# EAGLE design ups-node-atmega168 (EAGLE 7.4.0)
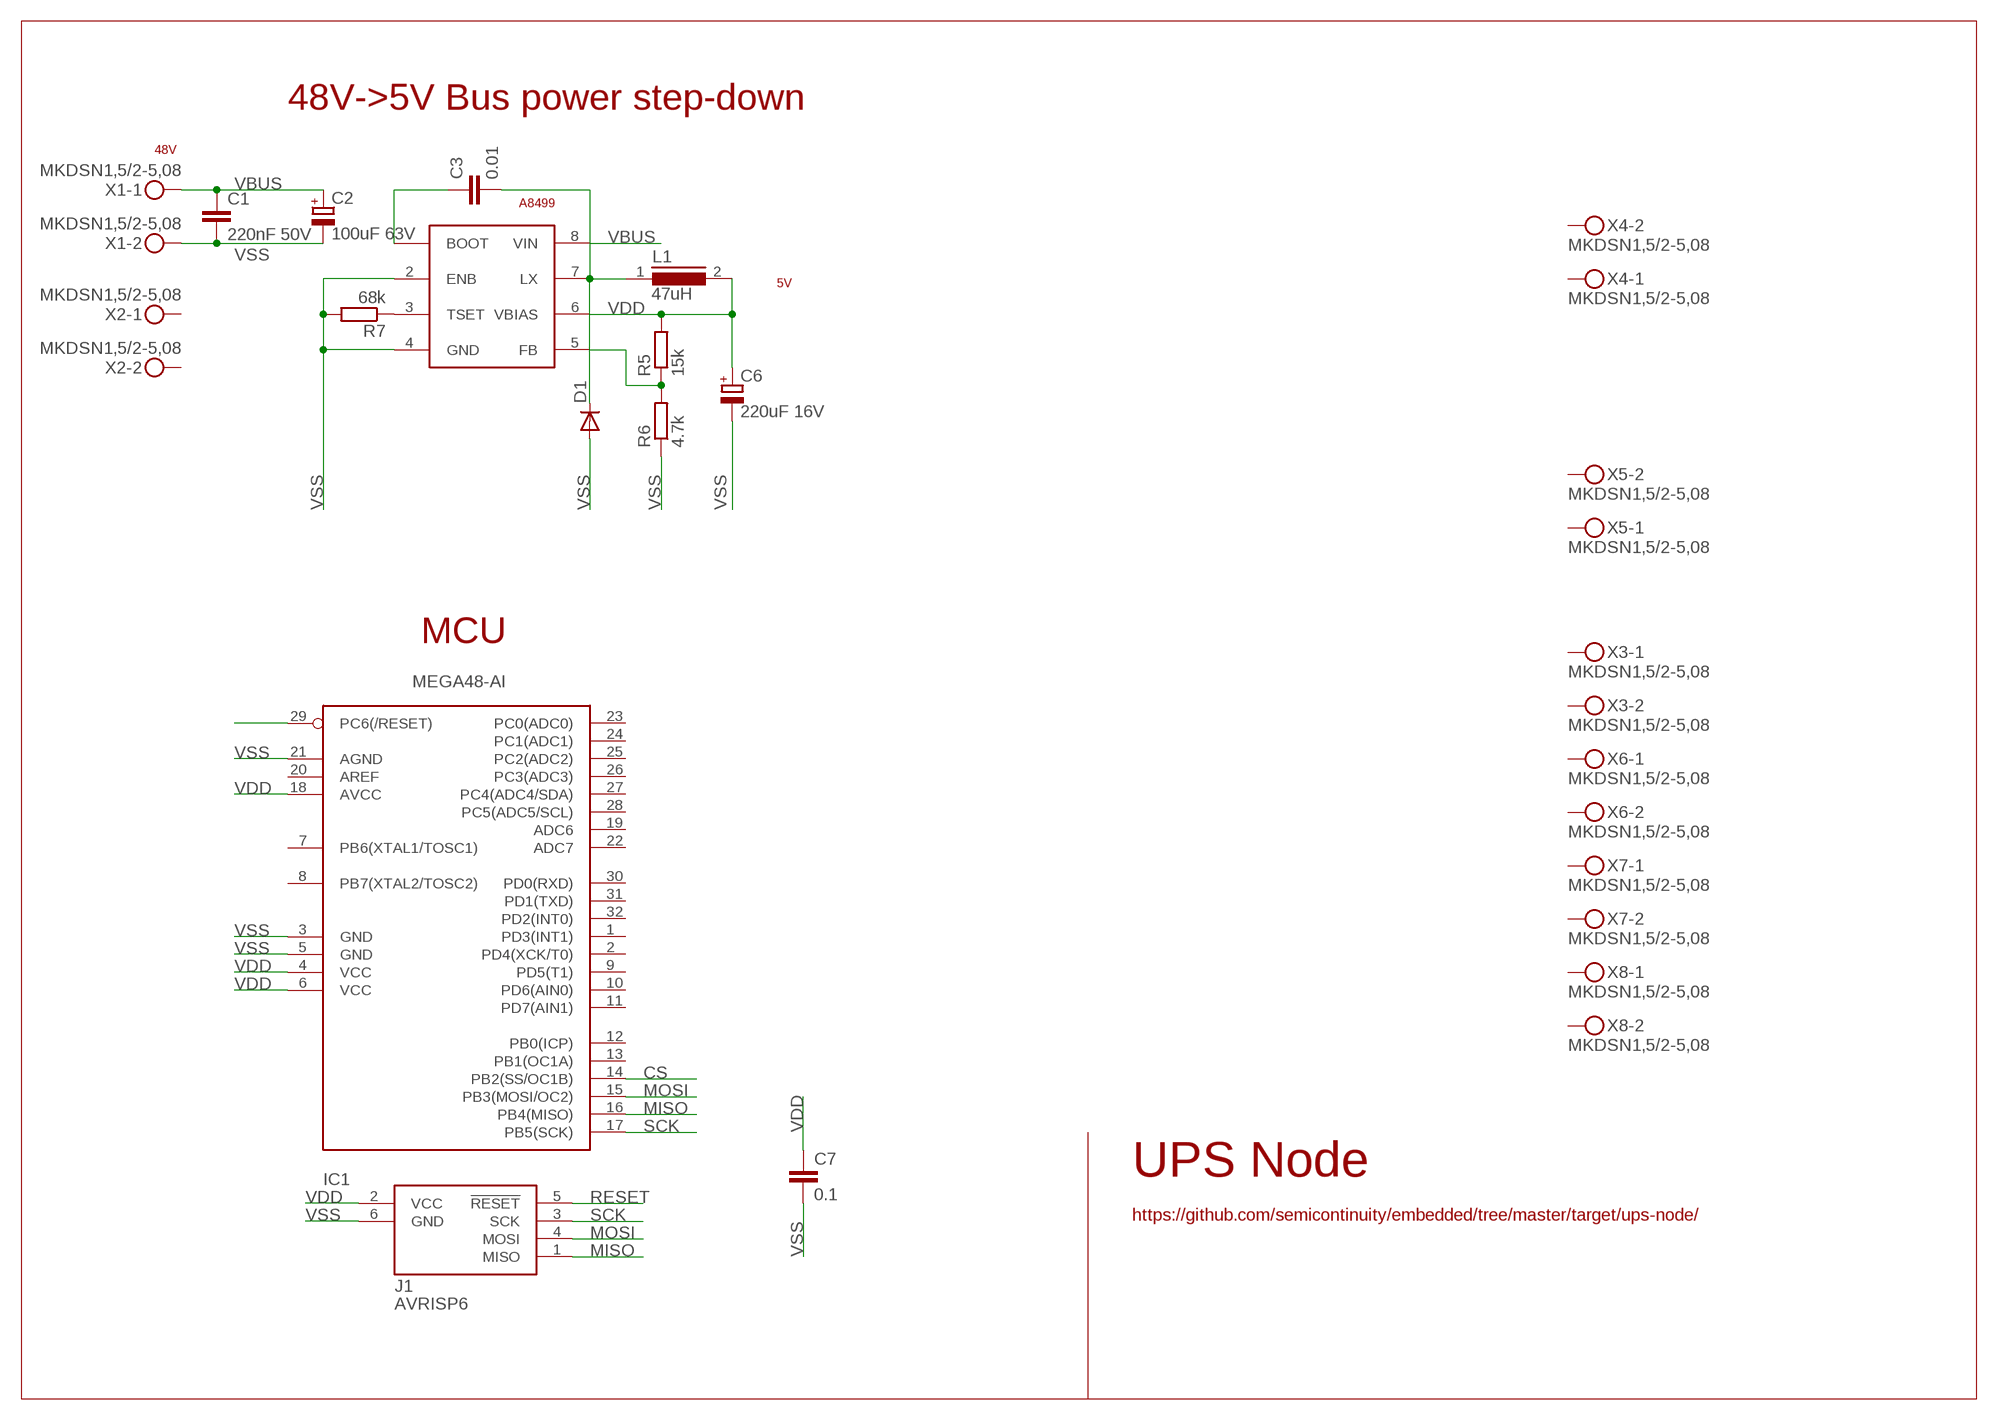
[diagram p0: schematic, sheet 1]

## Parts
C1  220nF 50V  C-EUC0805  [C0805]
C2  100uF 63V  CPOL-EU153CLV-1010  [153CLV-1010]
C3  0.01  C-EUC0805  [C0805]
C6  220uF 16V  CPOL-EU153CLV-0605  [153CLV-0605]
C7  0.1  C-EUC0805  [C0805]
D1  DIODE-SMB  [SMB]
IC1  MEGA48-AI  MEGA8-AI  [TQFP32-08]
J1  AVRISP6  [CON6P2R]
L1  47uH  DR127  [DR127]
R5  15k  R-EU_R0805  [R0805]
R6  4.7k  R-EU_R0805  [R0805]
R7  68k  R-EU_R0805  [R0805]
U$1  A8499  A8499SLJT  [SO08]
X1  MKDSN1,5/2-5,08  [MKDSN1,5/2-5,08]
X2  MKDSN1,5/2-5,08  [MKDSN1,5/2-5,08]
X3  MKDSN1,5/2-5,08  [MKDSN1,5/2-5,08]
X4  MKDSN1,5/2-5,08  [MKDSN1,5/2-5,08]
X5  MKDSN1,5/2-5,08  [MKDSN1,5/2-5,08]
X6  MKDSN1,5/2-5,08  [MKDSN1,5/2-5,08]
X7  MKDSN1,5/2-5,08  [MKDSN1,5/2-5,08]
X8  MKDSN1,5/2-5,08  [MKDSN1,5/2-5,08]

## Nets
BOOT: C3.1 U$1.1(BOOT)
CS: IC1.14(PB2(SS/OC1B))
LX: C3.2 D1.C L1.1 U$1.7(LX)
MISO: IC1.16(PB4(MISO)) J1.1(MISO)
MOSI: IC1.15(PB3(MOSI/OC2)) J1.4(MOSI)
N$14: R5.1 R6.2 U$1.5(FB)
N$15: R7.1 U$1.3(TSET)
RESET: IC1.29(PC6(/RESET)) J1.5(!RESET)
SCK: IC1.17(PB5(SCK)) J1.3(SCK)
VBUS: C1.1 C2.+ U$1.8(VIN) X1.1
VDD: C6.+ C7.1 IC1.4(VCC) IC1.6(VCC) IC1.18(AVCC) J1.2(VCC) L1.2 R5.2 U$1.6(VBIAS)
VSS: C1.2 C2.- C6.- C7.2 D1.A IC1.3(GND) IC1.5(GND) IC1.21(AGND) J1.6(GND) R6.1 R7.2 U$1.2(ENB) U$1.4(GND) X1.2
Unconnected: IC1.1(PD3(INT1)) IC1.2(PD4(XCK/T0)) IC1.7(PB6(XTAL1/TOSC1)) IC1.8(PB7(XTAL2/TOSC2)) IC1.9(PD5(T1)) IC1.10(PD6(AIN0)) IC1.11(PD7(AIN1)) IC1.12(PB0(ICP)) IC1.13(PB1(OC1A)) IC1.19(ADC6) IC1.20(AREF) IC1.22(ADC7) IC1.23(PC0(ADC0)) IC1.24(PC1(ADC1)) IC1.25(PC2(ADC2)) IC1.26(PC3(ADC3)) IC1.27(PC4(ADC4/SDA)) IC1.28(PC5(ADC5/SCL)) IC1.30(PD0(RXD)) IC1.31(PD1(TXD)) IC1.32(PD2(INT0)) X2.1 X2.2 X3.1 X3.2 X4.1 X4.2 X5.1 X5.2 X6.1 X6.2 X7.1 X7.2 X8.1 X8.2

## Notes on the sheet
- 48V->5V Bus power step-down
- 48V
- A8499
- 5V
- MCU
- UPS Node
- https://github.com/semicontinuity/embedded/tree/master/target/ups-node/

## Library data of the parts
C1 C3 C7 = rcl:C-EU: CAPACITOR, European symbol
C2 C6 = rcl:CPOL-EU: POLARIZED CAPACITOR, European symbol
D1 = diode:DIODE-: DIODE
IC1 = my-atmel:MEGA8: MICROCONTROLLER 8 Kbytes FLASH 1 kbytes SRAM 512 bytes EEPROM USART 6-channel 10 bit ADC 2-channel 8 bit ADC
J1 = ads4:AVRISP6: 6-pin dual-row connector for Atmel AVRISP programmer interface
L1 = inductors:DR127: High Power Density, High Efficiency, Shielded Inductors Source: coiltronics_dr_series.pdf
R5-R7 = rcl:R-EU_: RESISTOR, European symbol
U$1 = my-allegro:A8499SLJT: A8499SLJT Allegro Microsystems Step-Down regulator, 8V-50V, 1.5A, SO8
X1-X8 = con-phoenix-508:MKDSN1,5/2-5,08: MKDSN 1,5/ 2-5,08 Printklemme Nennstrom: 13,5 A Nennspannung: 250 V Rastermaß: 5,08 mm Polzahl: 2 Anschlussart: Schraubanschluss Montage: Löten Anschlussrichtung Leiter/Platine: 0 ° Artikelnummer: 1729128 Source: http://eshop.phoenixcontact.com .. 1729128.pdf; MPN: MKDSN 1,5/2-5.08; OC_FARNELL: 1792903; OC_NEWARK: 30M2397

## Board
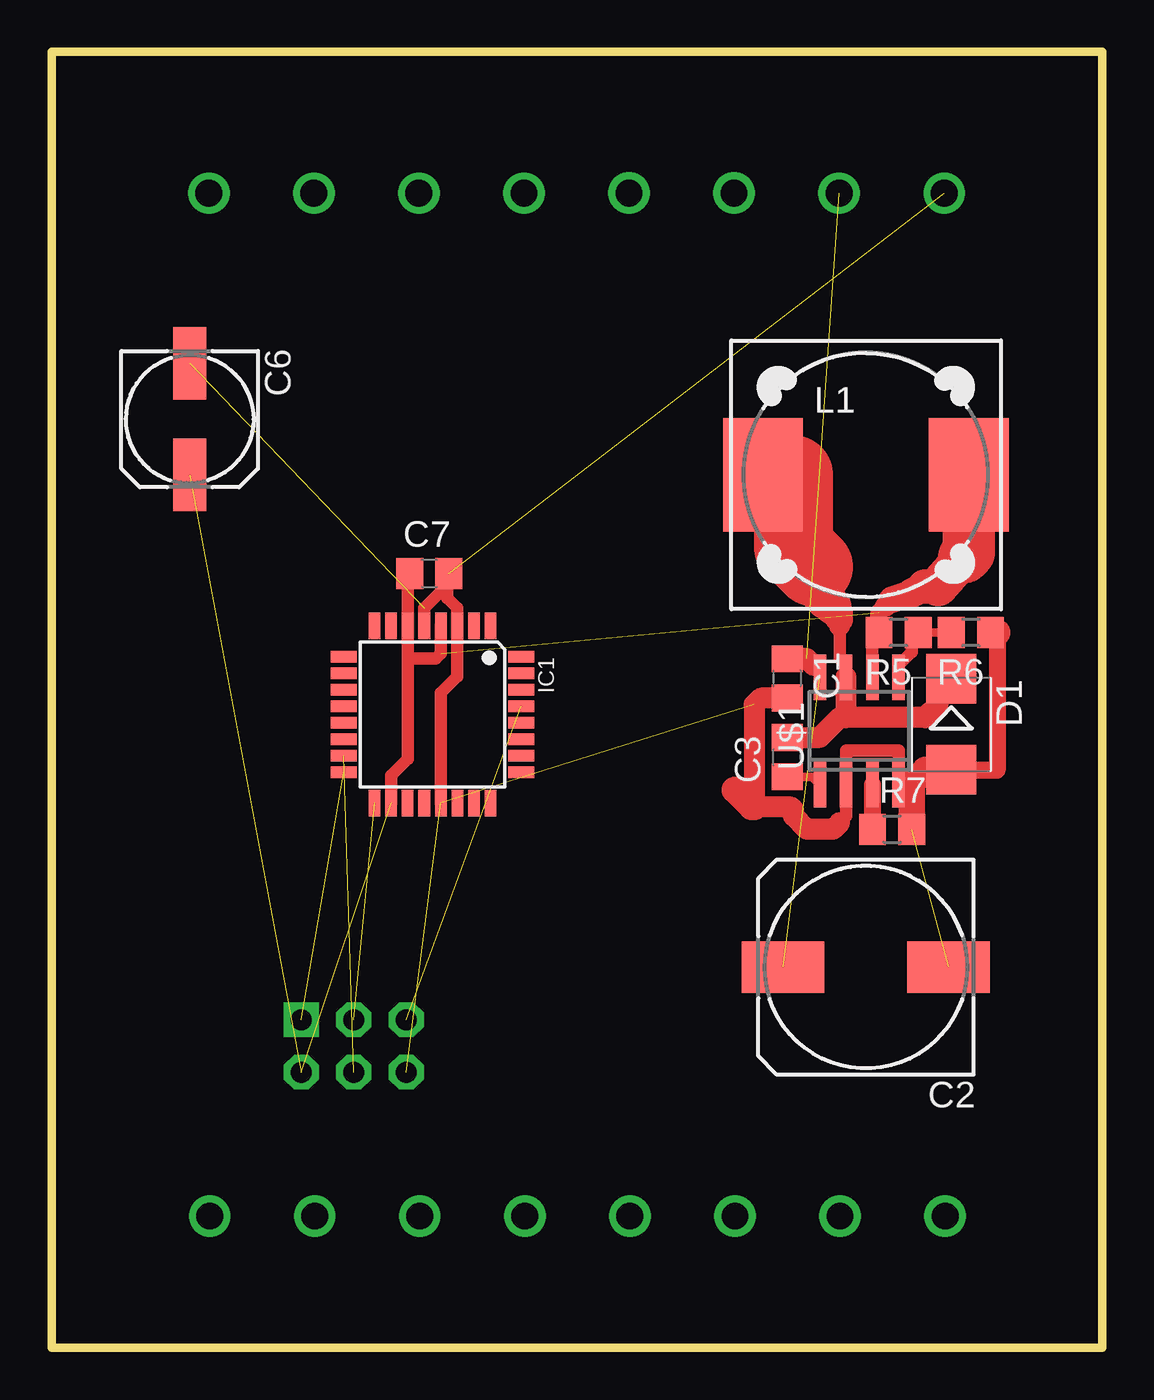
[diagram p1: board, top side]
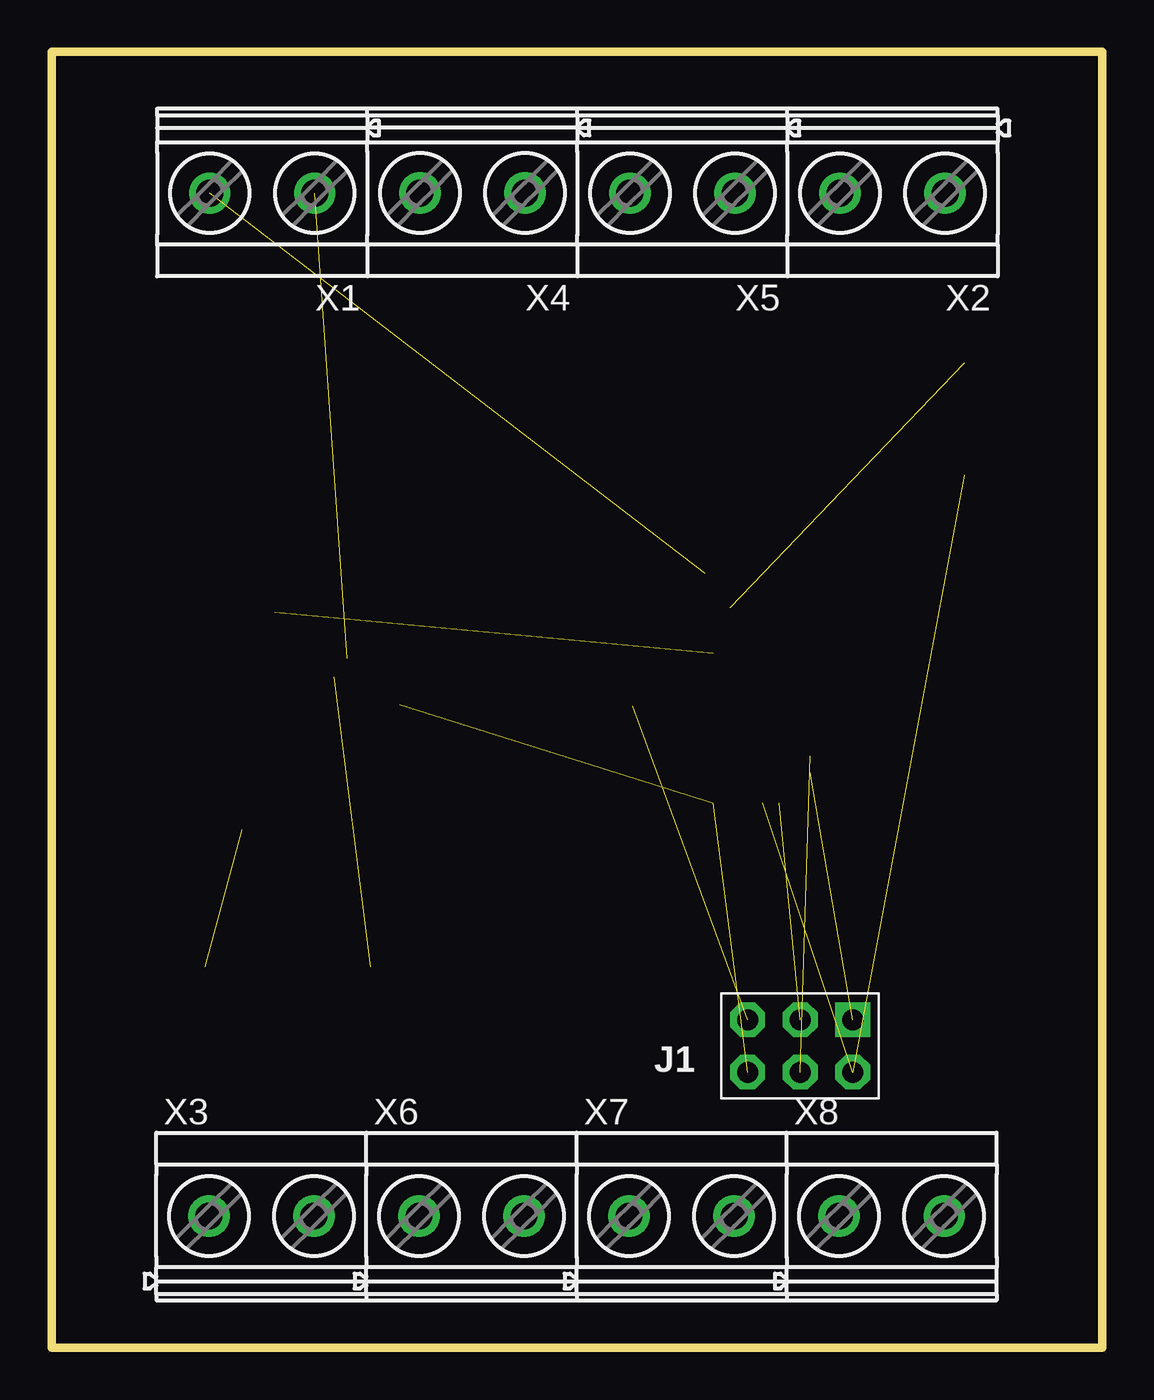
[diagram p2: board, bottom side, seen from below]

Size 50.8 x 62.7 mm. Coordinates in mm from the lower left corner, seen from the top.
Outline: 50.8,0 50.8,62.7 0,62.7 0,0 50.8,0
Outline: 50.8,0 50.8,0
Copper layers (1*16): Top 0.035mm / dielectric 1.5mm / Bottom 0.035mm
Design rules "default": minimum track width 10mil, minimum drill 24mil, track to track 8mil, track to pad 8mil, pad to pad 8mil, via to via 8mil, smd to smd 8mil, copper to edge 40mil, drill to drill 8mil, minimum pad ring 10mil, minimum via ring 8mil, stop-mask expansion 4mil, vias tented up to drill 0mil, thermal gap 10mil

### Footprints (pad centres in the part's own frame; a part is rotated, then mirrored left to right if it is on the bottom)
C0805 = smd 1.3 x 1.5: 1 -0.95,0; 2 0.95,0
153CLV-1010 = smd 4 x 2.5: + 4,0; - -4,0
153CLV-0605 = smd 3.5 x 1.6: + 2.7,0; - -2.7,0
SMB = smd 2.4 x 2.4: A 2.2,0; C -2.2,0
TQFP32-08 = smd 1.27 x 0.559: 1 -4.293,2.8; 2 -4.293,2; 3 -4.293,1.2; 4 -4.293,0.4; 5 -4.293,-0.4; 6 -4.293,-1.2; 7 -4.293,-2; 8 -4.293,-2.8; 17 4.293,-2.8; 18 4.293,-2; 19 4.293,-1.2; 20 4.293,-0.4; 21 4.293,0.4; 22 4.293,1.2; 23 4.293,2; 24 4.293,2.8 | smd 0.559 x 1.27: 9 -2.8,-4.293; 10 -2,-4.293; 11 -1.2,-4.293; 12 -0.4,-4.293; 13 0.4,-4.293; 14 1.2,-4.293; 15 2,-4.293; 16 2.8,-4.293; 25 2.8,4.293; 26 2,4.293; 27 1.2,4.293; 28 0.4,4.293; 29 -0.4,4.293; 30 -1.2,4.293; 31 -2,4.293; 32 -2.8,4.293
CON6P2R = drill 1.016 pad 1.676 square: 1 -2.54,-1.27 | drill 1.016 pad 1.676 octagon: 2 -2.54,1.27; 3 0,-1.27; 4 0,1.27; 5 2.54,-1.27; 6 2.54,1.27
DR127 = smd 3.85 x 5.5: 1 -4.975,0; 2 4.975,0
R0805 = smd 1.3 x 1.5: 1 -0.95,0; 2 0.95,0
SO08 = smd 0.6 x 2.2: 1 -1.905,-2.6; 2 -0.635,-2.6; 3 0.635,-2.6; 4 1.905,-2.6; 5 1.905,2.6; 6 0.635,2.6; 7 -0.635,2.6; 8 -1.905,2.6
MKDSN1,5/2-5,08 = drill 1.3 pad 2: 1 -2.561,0.025; 2 2.519,0.025

### Placement (x,y rotation side)
C1  35.56,32.38 270 top
C2  39.37,18.41 180 top
C3  35.56,28.57 90 top
C6  6.67,44.93 270 top
C7  18.26,37.47 0 top
D1  43.5,30.16 270 top
IC1  18.41,30.64 270 top
J1  14.61,14.61 180 bottom
L1  39.37,42.23 0 top
R5  40.96,34.61 180 top
R6  44.45,34.61 180 top
R7  40.64,25.08 0 top
U$1  39.05,29.84 0 top
X1  40.64,55.88 180 bottom
X2  10.16,55.88 180 bottom
X3  40.64,6.35 0 bottom
X4  30.48,55.88 180 bottom
X5  20.32,55.88 180 bottom
X6  30.48,6.35 0 bottom
X7  20.32,6.35 0 bottom
X8  10.16,6.35 0 bottom

### Tracks (layer width: path | path; a pad name or v marks a point on that pad's centre or on a via)
BOOT
  Top 0.406: U$1.1 36.77,27.62 C3.1
LX
  Top 0.406: 43.48,32.36 D1.C 44.11,32.36 44.13,32.38
  Top 0.61: U$1.7 38.42,33.02 38.1,33.34 38.1,34.92
  Top 1.016: 38.1,34.92 38.1,35.24 | 43.48,32.36 42.86,31.75 42.86,31.11 42.23,30.48 38.42,30.48 | 38.42,30.48 U$1.7 | C3.2 37.15,29.53 38.1,30.48 38.42,30.48
  Top 1.27: 38.1,35.24 37.78,35.56 38.1,35.56 37.78,35.88
  Top 1.778: 37.78,35.88 37.47,36.2
  Top 1.93: 37.47,36.2 37.15,36.51 37.15,36.83
  Top 2.184: 37.15,36.83 36.83,37.15 36.83,37.78
  Top 3.81: 36.83,37.78 35.88,38.73 35.88,42.23 L1.1
MISO  (1 unrouted)
MOSI  (1 unrouted)
N$14
  Top 0.406: R5.1 R6.2
  Top 0.61: R5.1 41.59,34.29 41.59,33.66 40.96,33.02 U$1.5
N$15
  Top 0.406: R7.1
  Top 0.813: U$1.3 R7.1
RESET  (1 unrouted)
SCK  (1 unrouted)
VBUS  (2 unrouted)
  Top 0.61: U$1.8 37.15,32.7 36.83,33.02
  Top 1.016: 36.83,33.02 36.52,33.34 C1.1
  Top 1.27: C1.1
VDD  (3 unrouted)
  Top 0.406: 39.69,34.6 R5.2 40.01,34.92 | 44.34,40.22 L1.2
  Top 0.61: 39.69,34.6 U$1.6 | 17.21,33.5 IC1.6 17.21,37.37 C7.1 | 17.21,33.5 17.21,28.49 16.41,27.69 IC1.18 | 17.21,33.5 17.37,33.34 18.57,33.34 18.82,33.58 IC1.4
  Top 0.813: 40.01,34.92 40.01,35.56 40.32,35.88
  Top 1.016: 40.32,35.88 40.64,36.2
  Top 1.27: 40.64,36.2 41.59,36.51
  Top 1.422: 41.59,36.51 42.23,36.83
  Top 1.676: 42.23,36.83 42.86,36.83
  Top 1.93: 42.86,36.83 44.13,38.26
  Top 2.54: 44.13,38.26 44.34,38.47 L1.2
VSS  (5 unrouted)
  Top 0.406: R7.2 | 40.96,27.3 U$1.4
  Top 0.61: 38.1,25.4 38.42,25.72 U$1.2 38.42,28.89 40.96,28.89 U$1.4 41.53,27.25 41.59,27.3 | IC1.21 18.82,31.67 19.61,32.47 IC1.3 19.61,35.79 19.13,36.27 19.13,36.91 | IC1.5 18.02,35.8 19.13,36.91 | 19.13,36.91 19.21,36.99 C7.2
  Top 0.813: 45.72,34.61 45.72,27.94 43.5,27.94
  Top 1.016: C1.2 34.29,31.43 33.97,31.11 33.97,26.16 35.75,26.16 35.88,26.04 35.88,25.72 36.51,25.08 37.78,25.08 38.1,25.4
  Top 1.27: 33.02,26.99 33.84,26.16 33.97,26.16 | R7.2 41.59,27.3 42.25,27.96 D1.A 43.5,27.94 | R6.1 45.72,34.61